# Altium schematic sheet Negative_Output.SchDoc
size A; SheetNumber: 5; SheetTotal: 8
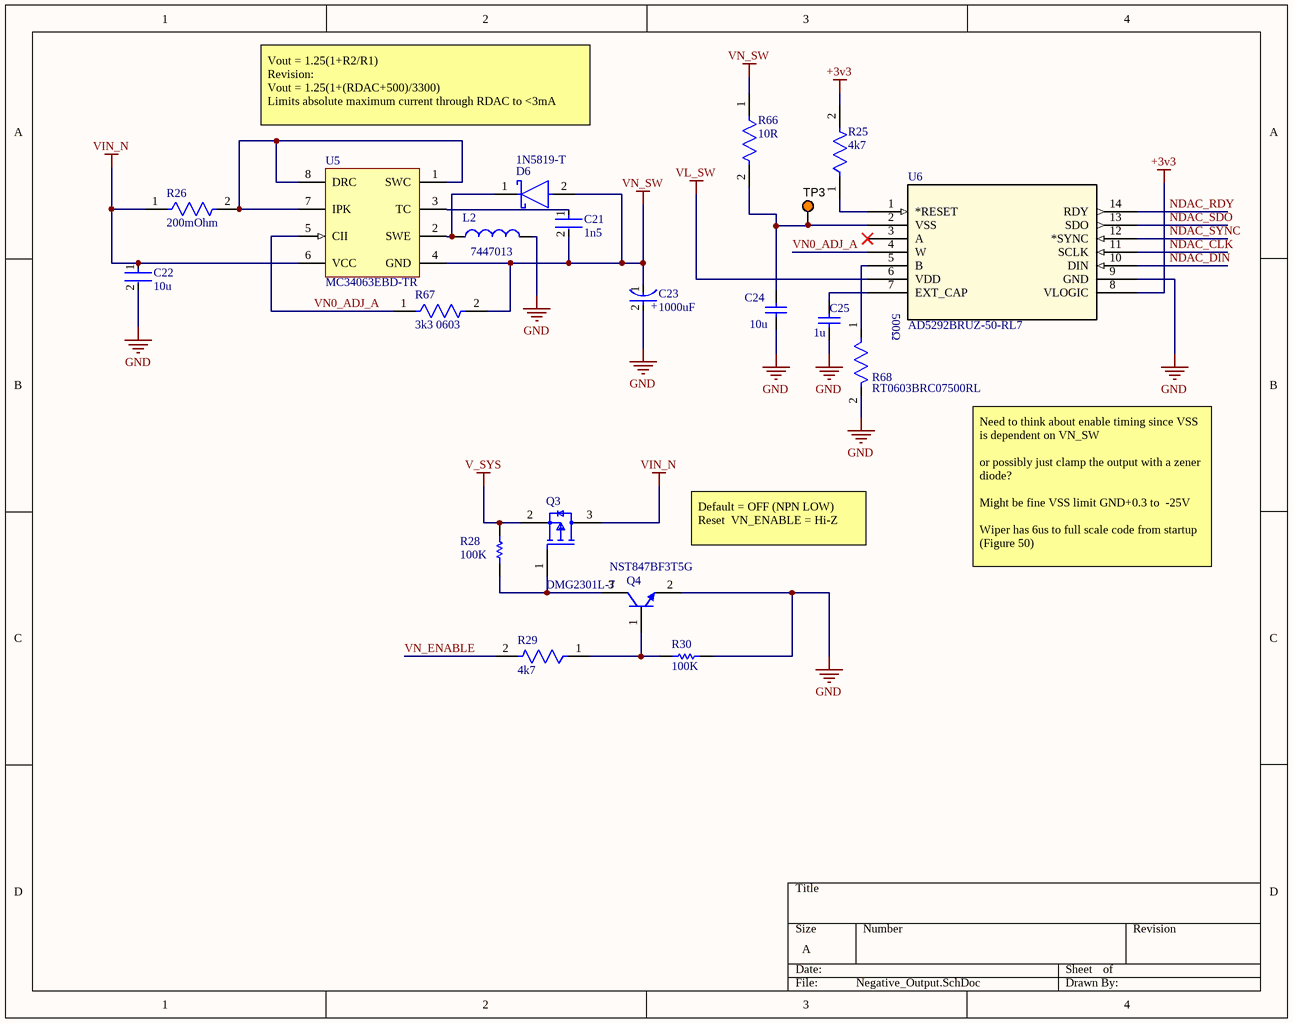
[diagram p0: Negative_Output.SchDoc]

## Parts
C21  1n5  [FP-C0603C-CF-MFG]
C22  10u  [FP-C0805X106K8RACAUTO-MFG]
C23  1000uF  [FP-FTG-MFG]
C24  10u  [CAPC2013X145X50NL20T25]
C25  1u  [CAPC2013X145X50NL20T25]
D6  1N5819-T  [FP-DO-41_Plastic-MFG]
L2  7447013  [7447013]
Q3  DMG2301L-7  [FP-SOT23-MFG]
Q4  NST847BF3T5G  [ONSC-SOT-1123-3-524AA_V]
R25  4k7  [FP-AC0603-IPC_A]
R26  200mOhm  [FP-CSR0603-IPC_A]
R28  100K  [RESC0603(1608)_N]
R29  4k7  [FP-AC0603-IPC_A]
R30  100K  [RESC0603(1608)_N]
R66  10R  [FP-SR0603-MFG]
R67  3k3 0603  [FP-AC0603-IPC_C]
R68  RT0603BRC07500RL  [RESC16080X45_RT0603-0_55_MFG]
TP3  5003  [KSTN-5003]  (value not drawn)
U5  MC34063EBD-TR  [SO8_M]
U6  AD5292BRUZ-50-RL7  [RU-14_ADI]

## Nets
+3v3: R25.2 U6.8(VLOGIC)
GND: C22.2 C23.2(A) C24.1 C25.1 L2.2 Q4.2(E) R30.1 R68.2 U6.9(GND)
V_SYS: Q3.2(S) R28.2
VIN_N: C22.1 Q3.3(D) R26.1 U5.6(VCC)
VL_SW: U6.6(VDD)
VN_SW: C21.2 C23.1(C) D6.2(A) R66.1 R67.2 U5.4(GND)
NDAC_CLK: U6.11(SCLK)
NDAC_DIN: U6.10(DIN)
NDAC_RDY: U6.14(RDY)
NDAC_SDO: U6.13(SDO)
NDAC_SYNC: U6.12(*SYNC)
VN0_ADJ_A: R67.1 U5.5(CII) U6.4(W)
VN_ENABLE: R29.2
NetC21_1: C21.1 U5.3(TC)
NetC24_2: C24.2 R66.2 TP3.1 U6.2(VSS)
NetC25_2: C25.2 U6.7(EXT_CAP)
NetD6_1: D6.1(C) L2.1 U5.2(SWE)
NetQ3_1: Q3.1(G) Q4.3(C) R28.1
NetQ4_1: Q4.1(B) R29.1 R30.2
NetR25_1: R25.1 U6.1(*RESET)
NetR26_2: R26.2 U5.1(SWC) U5.7(IPK) U5.8(DRC)
NetR68_1: R68.1 U6.5(B)

Not connected (* = marked no-connect by the designer): U6 3(A)*

## Notes on the sheet
- Vout = 1.25(1+R2/R1)
  Revision:
  Vout = 1.25(1+(RDAC+500)/3300)
  Limits absolute maximum current through RDAC to <3mA
- Default = OFF (NPN LOW)
  Reset  VN_ENABLE = Hi-Z
- Need to think about enable timing since VSS is dependent on VN_SW
  or possibly just clamp the output with a zener diode?
  Might be fine VSS limit GND+0.3 to  -25V
  Wiper has 6us to full scale code from startup
  (Figure 50)
- (in symbol CMP-05427-000029-1) +

## Library data of the parts
C21 = CMP-03020-017874-1: C0603 1,500 pF X7R 30ppm/°C 5.00% 50 V; Manufacturer Part Number: C0603C152J5RACAUTO; Manufacturer: KEMET; Tolerance: 0.05; Material: Ceramic; Voltage Rating: 50 V; Automotive Grade: Grade 1; Temperature Coefficient: 30ppm/°C; Lead Free: Yes; Automotive: Yes; Capacitance: 1,500 pF; Height: 0.87mm; Octopart: https://octopart.com/c0603c152j5racauto-kemet-48652793; Package: C0603C-CF; Device Class L1: Passive Components; RoHS: TRUE; Temperature Range Low: -55°C; ComponentLink2URL: https://api.kemet.com/component-edge/download/datasheet/C0603C100J5GACAUTO.pdf; ComponentLink2Description: Datasheet; Device Class L2: Capacitors; Device Class L3: Ceramic Capacitors; Category: Cap; Temperature: -55°C to +125°C; Temperature Range High: +125°C; Temperature Characteristic: X7R; Value: 1,500 pF
C22 = CMP-03020-034694-1: CAP CER 10UF 10V X7R 0805; Tolerance: 10%; Case/Package: 0805; Min Operating Temperature: -55°C; Max Operating Temperature: 125°C; RoHS Compliant: Yes; Ratings: AEC-Q200; Mount: Surface Mount; Features: Soft Termination; Capacitance: 10uF; Packaging: Cut Tape; Case Code (Metric): 2012; Voltage Rating: 10V; Case Code (Imperial): 0805
C23 = CMP-05427-000029-1: CAP ALUM 1000UF 20% 25V SMD
C24 C25 = CMP-2007-01213-1: Part Number: C0805C106M9RACTU; Manufacturer: Kemet
D6 = CMP-12790-000042-1: DIODE SCHOTTKY 40V 1A DO41; Manufacturer: Diodes Inc.; Max Surge Forward Current: 25A; Capacitance: 110 pF; Max Junction Temp: +125°C; Peak Reverse Current: 1mA; Value: 110 pF; Temperature Range Low: -65°C; Footprint Url: https://www.diodes.com/assets/Package-Files/DO-41-Plastic.pdf; Digikey Description: DIODE SCHOTTKY 40V 1A DO41; Category: Diode; Mouser Description: Schottky Diodes & Rectifiers Vr/40V Io/1A T/R; Device Class L2: Diodes; Temperature Range High: +125°C; RoHS: TRUE; Device Class L3: Schottky Diodes; ComponentLink2Description: Datasheet; Temperature: -65°C to +125°C; Reverse Voltage: 40V; Height: 2.72mm; ComponentLink2URL: https://www.diodes.com/assets/Datasheets/ds23001.pdf; Forward Current: 1A; Manufacturer Part Number: 1N5819-T; Lead Free: Yes; Device Class L1: Discrete Semiconductors; Max Repetitive Reverse Voltage: 40V; Ipc Land Pattern Name: DIOPA1091W105L521D272; Automotive: No; Package: DO-41 (Plastic); Octopart: https://octopart.com/1n5819-t-diodes+inc.-55389586
L2 = CMP-03913-130924366-2: Toroidal Inductors, 90Uh, 0.04 Ohm, 4.6A Rohs Compliant: Yes; Inductance: 90µH; Pin Length: 15mm; RoHS: Compliant; Max Operating Temperature: 105°C; Width: 10.5mm; Length: 18.5mm; Ambient Temperature Range High: 65°C; Min Operating Temperature: -40°C; Ambient Temperature Range Low: -40°C; Current Rating: 4.6A
Q3 = CMP-12801-000065-1: MOSFET P-CH 20V 3A SOT23; Manufacturer: Diodes Inc.; Number Of Channels: 1; Turn On Delay Time: 5ns; Drain To Source Resistance: 120mΩ; Max Junction Temp: +150°C; Gate To Source Voltage: 8V; Power Dissipation: 1.5W; Rthja Max: 83°C/W; Max Forward Diode Voltage: -1.2V; Standoff Height: 0.013mm; Threshold Vgs Min: -0.4V; Input Capacitace At Vds: 476pF @ -10V; Depletion Mode: False; Gate Charge At Vgs: 5.5nC @ -4.5V; Pulse Drain Current: -10A; Drain To Source Voltage: -20V; Continuous Drain Current: -3A; Turn Off Delay Time: 30ns; Lead Free: Yes; Package: SOT23; ComponentLink2Description: Datasheet; Device Class L3: MOSFETs; Device Class L1: Discrete Semiconductors; Manufacturer Part Number: DMG2301L-7; Automotive: No; Height: 1.1mm; Category: Trans; Temperature Range High: +150°C; Digikey Description: MOSFET P-CH 20V 3A SOT23; RoHS: TRUE; Number Of P Channels: 1; Footprint Url: https://www.diodes.com/assets/Package-Files/SOT23.pdf; Octopart: https://octopart.com/dmg2301l-7-diodes+inc.-67250456; ComponentLink2URL: https://www.diodes.com/assets/Datasheets/DMG2301L.pdf; Mouser Description: Single P-Channel 20 V 1.5 W 5.5 nC Silicon Surface Mount Mosfet - SOT-23; Drain To Source Breakdown Voltage: -20V; Threshold Vgs Max: -1.2V; Device Class L2: Transistors; Temperature: -55°C to +150°C; Temperature Range Low: -55°C
Q4 = CMP-1048-00443-1: NPN General Purpose Transistor, 3-Pin SOT-1123, Pb-Free, Tape and Reel; Manufacturer: On Semiconductor; fT Min (MHz): 100; IC Continuous (A): 0.1; RoHS: TRUE; PartNumber: NST847BF3T5G; Packing: Tape and Reel; ComponentLink3Description: Package Specification; ComponentLink2URL: http://www.onsemi.com/pub_link/Collateral/NST847BF3-D.PDF; PackageReference: SOT-1123-3-524AA; PackageDescription: 3-Pin Small Outline Transistor, Body 0.8 x 0.6 mm, Pitch 0.375 mm; PackageVersion: Rev. C, 11/2011; ComponentLink1Description: Manufacturer URL; Mounting Technology: Surface Mount; ComponentLink2Description: Datasheet; ComponentLink1URL: http://www.onsemi.com/; DatasheetVersion: Rev. 1; Polarity: NPN; ComponentLink3URL: http://www.onsemi.cn/pub_link/Collateral/524AA.PDF
R25 R29 = CMP-03412-006483-2: RES 4.7KΩ 1.00% 0.1W 0603; Tolerance: 1%; Resistance: 4.7kR; Case/Package: 0603; RoHS Compliant: Yes
R26 = CMP-26527-003125-1: General Purpose Thick Film Chip Resistor, 0603, 0.2Ω, 1%, 300ppm/°C, 0.125W; Max Power Dissipation: 125mW; Resistance: 200mR; Resistor Type: Thick Film; Max Operating Temperature: 155°C; Radiation Hardening: No; Length: 0.063inch; Case Code (Metric): 1608; RoHS Compliant: Yes; Case Code (Imperial): 0603; Lead Free: Lead Free; Width: 0.031inch; Number of Terminations: 2; Series: CSR; Height: 0.022inch; Case/Package: 0603; Packaging: Tape and Reel; Mount: Surface Mount; Min Operating Temperature: -55°C; Temperature Coefficient: 300ppm/°C; Contact Plating: Tin; Tolerance: 1%
R28 R30 = CMP-1012-00736-1: 100K 0.1W 1% 0603 (1608 Metric)  SMD; Value: 100000.00 Ohm; Case-Metric: 1608; Case-EIA: 0603; Power: 0.1 W; Tolerance: 1 %; Technology: SMT
R66 = CMP-03412-016018-1: RES SMD 0603 1/4W 1% 10 OHM; Manufacturer Part Number: SR0603FR-7T10RL; Manufacturer: Yageo; Voltage Rating: 75V; Value: 10Ω; Tolerance: 0.01; Automotive Grade: Grade 0; Power Rating: 0.25W; Footprint Url: http://www.yageo.com/exep/pages/download/literatures/PYu-R_Mount_10.pdf; Digikey Description: RES SMD 0603 1/4W 1% 10 OHM; Device Class L2: Resistors; Octopart: https://octopart.com/sr0603fr-7t10rl-yageo-91478074; Temperature Range Low: -55°C; Device Class L3: Chip SMD Resistors; ComponentLink2Description: Datasheet; Height: 0.55mm; Automotive: Yes; Lead Free: Yes; Category: Res; Resistance: 10Ω; RoHS: TRUE; Series: SR; Temperature: -55°C to +155°C; Device Class L1: Passive Components; Temperature Range High: +155°C; Composition: Thick Film; Package: SR0603; ComponentLink2URL: http://www.yageo.com/documents/recent/PYu-SR_D_F%20tol_RoHS_L_3.pdf; Ipc Land Pattern Name: RESC16080X45
R67 = CMP-03412-041670-1: RES 3.3kΩ 1.00% 0.2W 0603; RoHS Compliant: Yes
R68 = CMP-00621-87214386-1: Fixed Resistor, Thin Film, 0.1W, 500ohm, 75V, 0.1% +/-Tol, 15ppm/Cel, Surface Mount, 0603; Temperature Coefficient: 15ppm/°C; Power Rating: 100mW; Resistance: 500Ω; ComponentLink1URL: http://www.yageo.com/; Min Operating Temperature: -55°C; ComponentLink1Description: Manufacturer URL; Tolerance: 0.1%; ComponentLink3URL: http://www.yageo.com/exep/pages/download/literatures/PYu-R_Mount_10.pdf; RoHS: Non-Compliant; Voltage Rating: 75V; Max Operating Temperature: 155°C; Height: 550µm; ComponentLink2URL: https://www.yageo.com/upload/media/product/productsearch/datasheet/rchip/PYu-RT_1-to-0.01_RoHS_L_15.pdf; Case/Package: 0603; Packaging: Tape & Reel; ComponentLink3Description: Package URL; Composition: Thin Film; ComponentLink2Description: Datasheet URL
TP3 = CMP-1672-00009-1: Test Point, Orange, 1-Pin THD, RoHS; Peak Reverse Current: 600 uA; Forward Current: 3 A; Max Surge Current: 80 A; Forward Voltage: 1.08 V; Max Operating Temperature: 150 degC; PackageReference: 5003; Pins: 2; ComponentLink2URL: http://keyelco.com/userAssets/file/M65p56.pdf; PackageDescription: 1-Pin Through Hole Device, Dia 2.54 mm; Weight: 0.01 lb; Diameter: 5.3 mm; Mount: Through Hole; Package Quantity: 500; Packaging: Bulk; Min Operating Temperature: -65 degC; ComponentLink1Description: Manufacturer URL; Height: 0.25 inch; ComponentLink1URL: http://www.keyelco.com/; ComponentLink2Description: Datasheet; Width: 0.25 inch; REACH SVHC: No SVHC; RoHSCompliant: true; Radiation Hardening: No; Length: 9.5 mm; DatasheetVersion: Jun-15
U5 = CMP-0241-00013-1: DC/DC converter control circuit, 8-Pin SO, Tape and Reel; ComponentLink2URL: http://www.st.com/internet/com/TECHNICAL_RESOURCES/TECHNICAL_LITERATURE/DATASHEET/CD00001232.pdf; ComponentLink1URL: http://www.st.com; PackageVersion: Dec-2002; Code_IPC: SOIC127P600-8; PackageDescription: 8-Pin Small Outline Integrated Circuit 1.27 mm Pitch; DatasheetVersion: Nov-2007; PackageReference: SO8; ComponentLink2Description: Datasheet; ComponentLink3Description: Package Specification; ComponentLink1Description: Manufacturer URL; Code_JEDEC: MS-012-AA; ComponentLink3URL: http://www.st.com/internet/com/TECHNICAL_RESOURCES/TECHNICAL_LITERATURE/PACKAGE_INFORMATION/CD00004680.pdf
U6 = AD5292BRUZ-50-RL7: 256-/1024-Position, Digital Potentiometers with Maximum Â±1% R-Tolerance Error and 20-TP Memory; Manufacturer_Name: Analog Devices Inc; Type: Data Acquisition; Copyright: Copyright (C) 2026 Ultra Librarian. All rights reserved.; Manufacturer_Part_Number: AD5292BRUZ-50-RL7; Datasheet: https://www.analog.com/media/en/technical-documentation/data-sheets/AD5291_5292.pdf; RefDes: RefDes